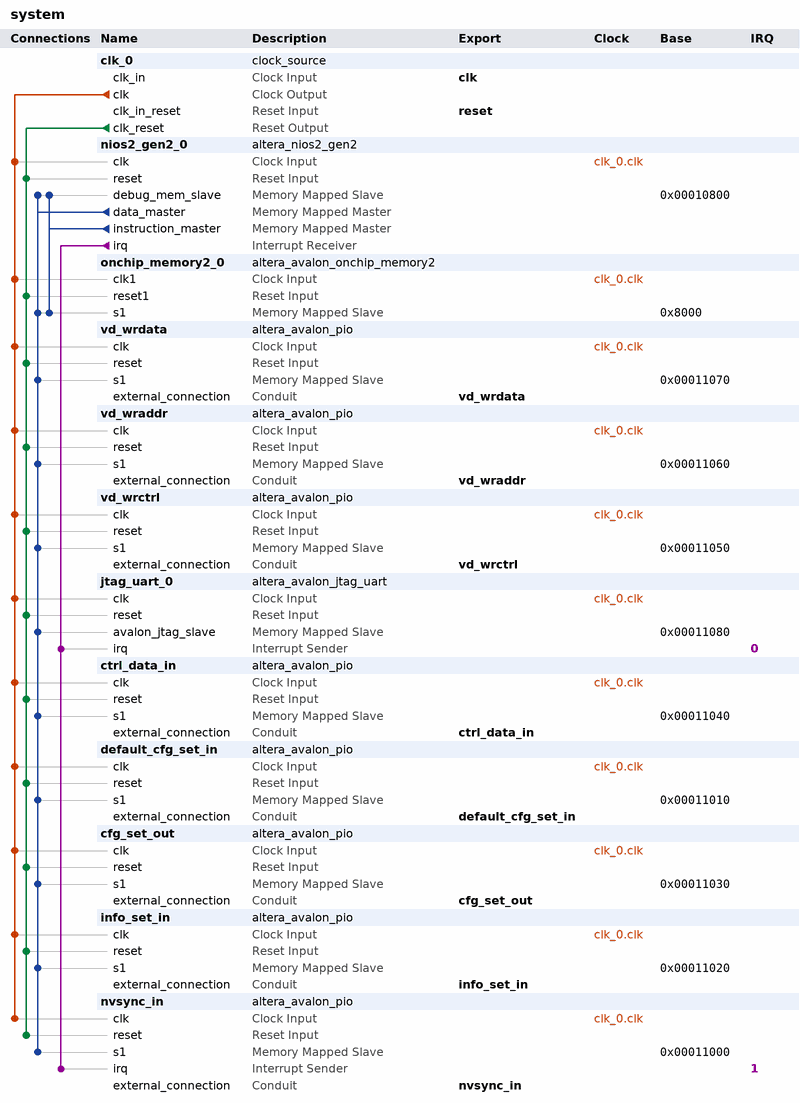
[diagram p0: system contents]
# Platform Designer (Qsys) system system, Cyclone 10 LP 10CL010YE144C8G
# Parameters at their usual value, and those the tool derives, are not listed.
package require -exact qsys 17.1
create_system system
set_project_property DEVICE_FAMILY {Cyclone 10 LP}
set_project_property DEVICE 10CL010YE144C8G

add_instance clk_0 clock_source 17.1
set_instance_parameter_value clk_0 clockFrequency 100000000

add_instance nios2_gen2_0 altera_nios2_gen2 17.1
set_instance_parameter_value nios2_gen2_0 dcache_size 2048
set_instance_parameter_value nios2_gen2_0 exceptionSlave onchip_memory2_0.s1
set_instance_parameter_value nios2_gen2_0 icache_size 4096
set_instance_parameter_value nios2_gen2_0 impl Tiny
set_instance_parameter_value nios2_gen2_0 resetSlave onchip_memory2_0.s1

add_instance onchip_memory2_0 altera_avalon_onchip_memory2 17.1
set_instance_parameter_value onchip_memory2_0 dataWidth 32
set_instance_parameter_value onchip_memory2_0 dualPort false
set_instance_parameter_value onchip_memory2_0 initMemContent true
set_instance_parameter_value onchip_memory2_0 initializationFileName software/controller_app/mem_init/system_onchip_memory2_0.hex
set_instance_parameter_value onchip_memory2_0 memorySize 30720
set_instance_parameter_value onchip_memory2_0 useNonDefaultInitFile true

add_instance vd_wrdata altera_avalon_pio 17.1
set_instance_parameter_value vd_wrdata direction Output
set_instance_parameter_value vd_wrdata width 13

add_instance vd_wraddr altera_avalon_pio 17.1
set_instance_parameter_value vd_wraddr direction Output
set_instance_parameter_value vd_wraddr width 10

add_instance vd_wrctrl altera_avalon_pio 17.1
set_instance_parameter_value vd_wrctrl direction Output
set_instance_parameter_value vd_wrctrl width 2

add_instance jtag_uart_0 altera_avalon_jtag_uart 17.1
set_instance_parameter_value jtag_uart_0 simInteractiveOptions NO_INTERACTIVE_WINDOWS
set_instance_parameter_value jtag_uart_0 useRegistersForReadBuffer true

add_instance ctrl_data_in altera_avalon_pio 17.1
set_instance_parameter_value ctrl_data_in direction Input
set_instance_parameter_value ctrl_data_in width 32

add_instance default_cfg_set_in altera_avalon_pio 17.1
set_instance_parameter_value default_cfg_set_in direction Input
set_instance_parameter_value default_cfg_set_in width 6

add_instance cfg_set_out altera_avalon_pio 17.1
set_instance_parameter_value cfg_set_out direction Output
set_instance_parameter_value cfg_set_out width 16

add_instance info_set_in altera_avalon_pio 17.1
set_instance_parameter_value info_set_in direction Input
set_instance_parameter_value info_set_in width 6

add_instance nvsync_in altera_avalon_pio 17.1
set_instance_parameter_value nvsync_in captureEdge true
set_instance_parameter_value nvsync_in direction Input
set_instance_parameter_value nvsync_in edgeType FALLING
set_instance_parameter_value nvsync_in generateIRQ true
set_instance_parameter_value nvsync_in irqType EDGE
set_instance_parameter_value nvsync_in width 1

# connections
add_connection clk_0.clk cfg_set_out.clk clock
add_connection clk_0.clk ctrl_data_in.clk clock
add_connection clk_0.clk default_cfg_set_in.clk clock
add_connection clk_0.clk info_set_in.clk clock
add_connection clk_0.clk jtag_uart_0.clk clock
add_connection clk_0.clk nios2_gen2_0.clk clock
add_connection clk_0.clk nvsync_in.clk clock
add_connection clk_0.clk onchip_memory2_0.clk1 clock
add_connection clk_0.clk vd_wraddr.clk clock
add_connection clk_0.clk vd_wrctrl.clk clock
add_connection clk_0.clk vd_wrdata.clk clock
add_connection clk_0.clk_reset cfg_set_out.reset reset
add_connection clk_0.clk_reset ctrl_data_in.reset reset
add_connection clk_0.clk_reset default_cfg_set_in.reset reset
add_connection clk_0.clk_reset info_set_in.reset reset
add_connection clk_0.clk_reset jtag_uart_0.reset reset
add_connection clk_0.clk_reset nios2_gen2_0.reset reset
add_connection clk_0.clk_reset nvsync_in.reset reset
add_connection clk_0.clk_reset onchip_memory2_0.reset1 reset
add_connection clk_0.clk_reset vd_wraddr.reset reset
add_connection clk_0.clk_reset vd_wrctrl.reset reset
add_connection clk_0.clk_reset vd_wrdata.reset reset
add_connection nios2_gen2_0.data_master cfg_set_out.s1 avalon
set_connection_parameter_value nios2_gen2_0.data_master/cfg_set_out.s1 baseAddress 0x00011030
add_connection nios2_gen2_0.data_master ctrl_data_in.s1 avalon
set_connection_parameter_value nios2_gen2_0.data_master/ctrl_data_in.s1 baseAddress 0x00011040
add_connection nios2_gen2_0.data_master default_cfg_set_in.s1 avalon
set_connection_parameter_value nios2_gen2_0.data_master/default_cfg_set_in.s1 baseAddress 0x00011010
add_connection nios2_gen2_0.data_master info_set_in.s1 avalon
set_connection_parameter_value nios2_gen2_0.data_master/info_set_in.s1 baseAddress 0x00011020
add_connection nios2_gen2_0.data_master jtag_uart_0.avalon_jtag_slave avalon
set_connection_parameter_value nios2_gen2_0.data_master/jtag_uart_0.avalon_jtag_slave baseAddress 0x00011080
add_connection nios2_gen2_0.data_master nios2_gen2_0.debug_mem_slave avalon
set_connection_parameter_value nios2_gen2_0.data_master/nios2_gen2_0.debug_mem_slave baseAddress 0x00010800
add_connection nios2_gen2_0.data_master nvsync_in.s1 avalon
set_connection_parameter_value nios2_gen2_0.data_master/nvsync_in.s1 baseAddress 0x00011000
add_connection nios2_gen2_0.data_master onchip_memory2_0.s1 avalon
set_connection_parameter_value nios2_gen2_0.data_master/onchip_memory2_0.s1 baseAddress 0x8000
add_connection nios2_gen2_0.data_master vd_wraddr.s1 avalon
set_connection_parameter_value nios2_gen2_0.data_master/vd_wraddr.s1 baseAddress 0x00011060
add_connection nios2_gen2_0.data_master vd_wrctrl.s1 avalon
set_connection_parameter_value nios2_gen2_0.data_master/vd_wrctrl.s1 baseAddress 0x00011050
add_connection nios2_gen2_0.data_master vd_wrdata.s1 avalon
set_connection_parameter_value nios2_gen2_0.data_master/vd_wrdata.s1 baseAddress 0x00011070
add_connection nios2_gen2_0.instruction_master nios2_gen2_0.debug_mem_slave avalon
set_connection_parameter_value nios2_gen2_0.instruction_master/nios2_gen2_0.debug_mem_slave baseAddress 0x00010800
add_connection nios2_gen2_0.instruction_master onchip_memory2_0.s1 avalon
set_connection_parameter_value nios2_gen2_0.instruction_master/onchip_memory2_0.s1 baseAddress 0x8000
add_connection nios2_gen2_0.irq jtag_uart_0.irq interrupt
set_connection_parameter_value nios2_gen2_0.irq/jtag_uart_0.irq irqNumber 0
add_connection nios2_gen2_0.irq nvsync_in.irq interrupt
set_connection_parameter_value nios2_gen2_0.irq/nvsync_in.irq irqNumber 1

# exported interfaces
add_interface cfg_set_out conduit end
set_interface_property cfg_set_out EXPORT_OF cfg_set_out.external_connection
add_interface clk clock sink
set_interface_property clk EXPORT_OF clk_0.clk_in
add_interface ctrl_data_in conduit end
set_interface_property ctrl_data_in EXPORT_OF ctrl_data_in.external_connection
add_interface default_cfg_set_in conduit end
set_interface_property default_cfg_set_in EXPORT_OF default_cfg_set_in.external_connection
add_interface info_set_in conduit end
set_interface_property info_set_in EXPORT_OF info_set_in.external_connection
add_interface nvsync_in conduit end
set_interface_property nvsync_in EXPORT_OF nvsync_in.external_connection
add_interface reset reset sink
set_interface_property reset EXPORT_OF clk_0.clk_in_reset
add_interface vd_wraddr conduit end
set_interface_property vd_wraddr EXPORT_OF vd_wraddr.external_connection
add_interface vd_wrctrl conduit end
set_interface_property vd_wrctrl EXPORT_OF vd_wrctrl.external_connection
add_interface vd_wrdata conduit end
set_interface_property vd_wrdata EXPORT_OF vd_wrdata.external_connection

set_interconnect_requirement {$system} qsys_mm.clockCrossingAdapter HANDSHAKE
set_interconnect_requirement {$system} qsys_mm.enableEccProtection FALSE
set_interconnect_requirement {$system} qsys_mm.insertDefaultSlave FALSE
set_interconnect_requirement {$system} qsys_mm.maxAdditionalLatency 1

save_system system.qsys
